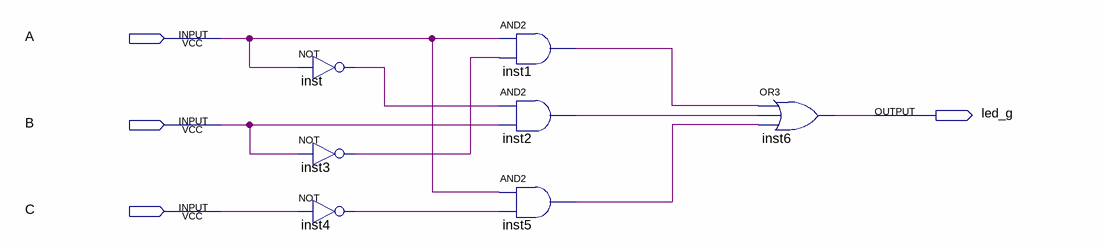
[diagram p0: schematic sheet]
// Quartus schematic led_g.bdf as structural Verilog: 7 symbols, 4 pins
module led_g (
  input  A,
  input  B,
  input  C,
  output led_g
);

  wire inst1_out, inst2_out, inst3_out, inst4_out, inst5_out, inst_out;

  not inst (inst_out, A);
  not inst3 (inst3_out, B);
  not inst4 (inst4_out, C);
  and inst1 (inst1_out, A, inst3_out);
  and inst2 (inst2_out, inst_out, B);
  and inst5 (inst5_out, A, inst4_out);
  or inst6 (led_g, inst1_out, inst2_out, inst5_out);
endmodule
